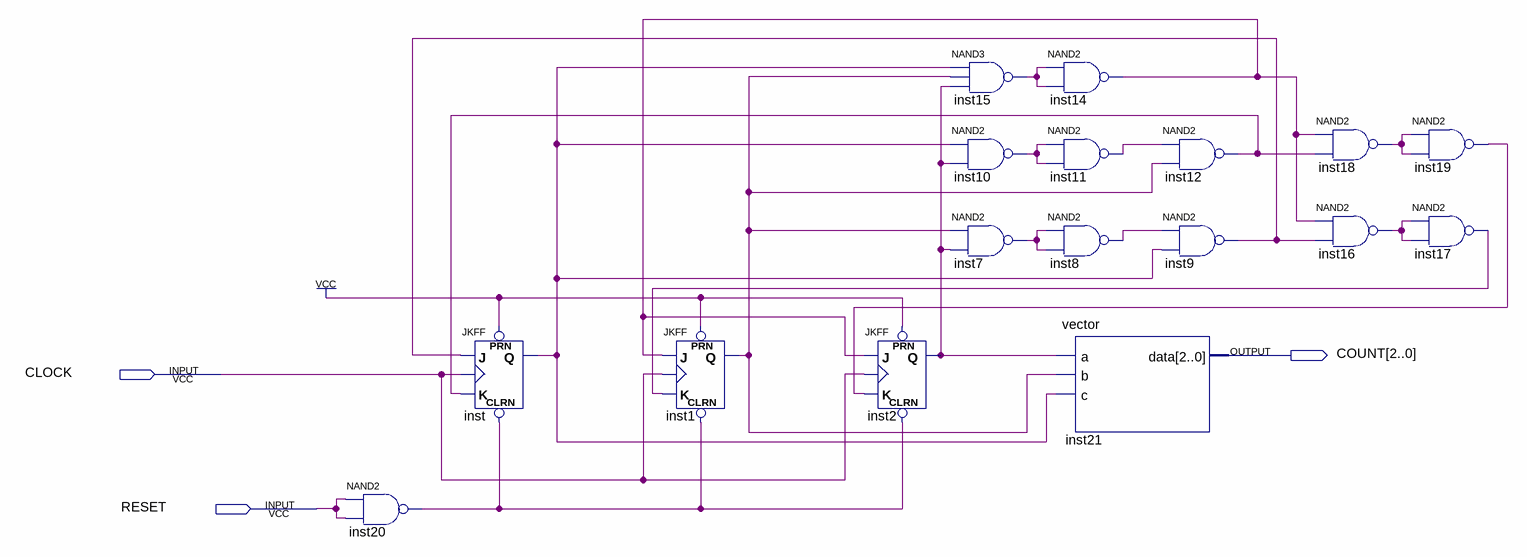
[diagram p0: schematic sheet]
// Quartus schematic Exp84.bdf as structural Verilog: 17 symbols, 3 pins
module Exp84 (
  input  CLOCK,
  input  RESET,
  output [2:0] COUNT
);

  wire inst1_q, inst2_q, inst7_out, inst8_out, inst9_out, inst10_out, inst11_out, inst12_out, inst14_out,
       inst15_out, inst16_out, inst17_out, inst18_out, inst19_out, inst20_out, inst_q;

  nand inst20 (inst20_out, RESET, RESET);
  JKFF inst (.PRN(1'b1), .CLRN(inst20_out), .K(inst12_out), .J(inst9_out), .CLK(CLOCK), .Q(inst_q));
  JKFF inst1 (.PRN(1'b1), .CLRN(inst20_out), .K(inst17_out), .J(inst14_out), .CLK(CLOCK), .Q(inst1_q));
  JKFF inst2 (.PRN(1'b1), .CLRN(inst20_out), .K(inst19_out), .J(inst14_out), .CLK(CLOCK), .Q(inst2_q));
  nand inst15 (inst15_out, inst_q, inst1_q, inst2_q);
  nand inst10 (inst10_out, inst_q, inst2_q);
  nand inst7 (inst7_out, inst1_q, inst2_q);
  nand inst14 (inst14_out, inst15_out, inst15_out);
  nand inst11 (inst11_out, inst10_out, inst10_out);
  nand inst8 (inst8_out, inst7_out, inst7_out);
  vector inst21 (.a(inst2_q), .b(inst1_q), .c(inst_q), .data(COUNT));
  nand inst12 (inst12_out, inst11_out, inst1_q);
  nand inst9 (inst9_out, inst8_out, inst_q);
  nand inst18 (inst18_out, inst14_out, inst12_out);
  nand inst16 (inst16_out, inst14_out, inst9_out);
  nand inst19 (inst19_out, inst18_out, inst18_out);
  nand inst17 (inst17_out, inst16_out, inst16_out);
endmodule
